# Altium schematic sheet Filter_Circuit.SchDoc
size A4; SheetNumber: 5; SheetTotal: 6
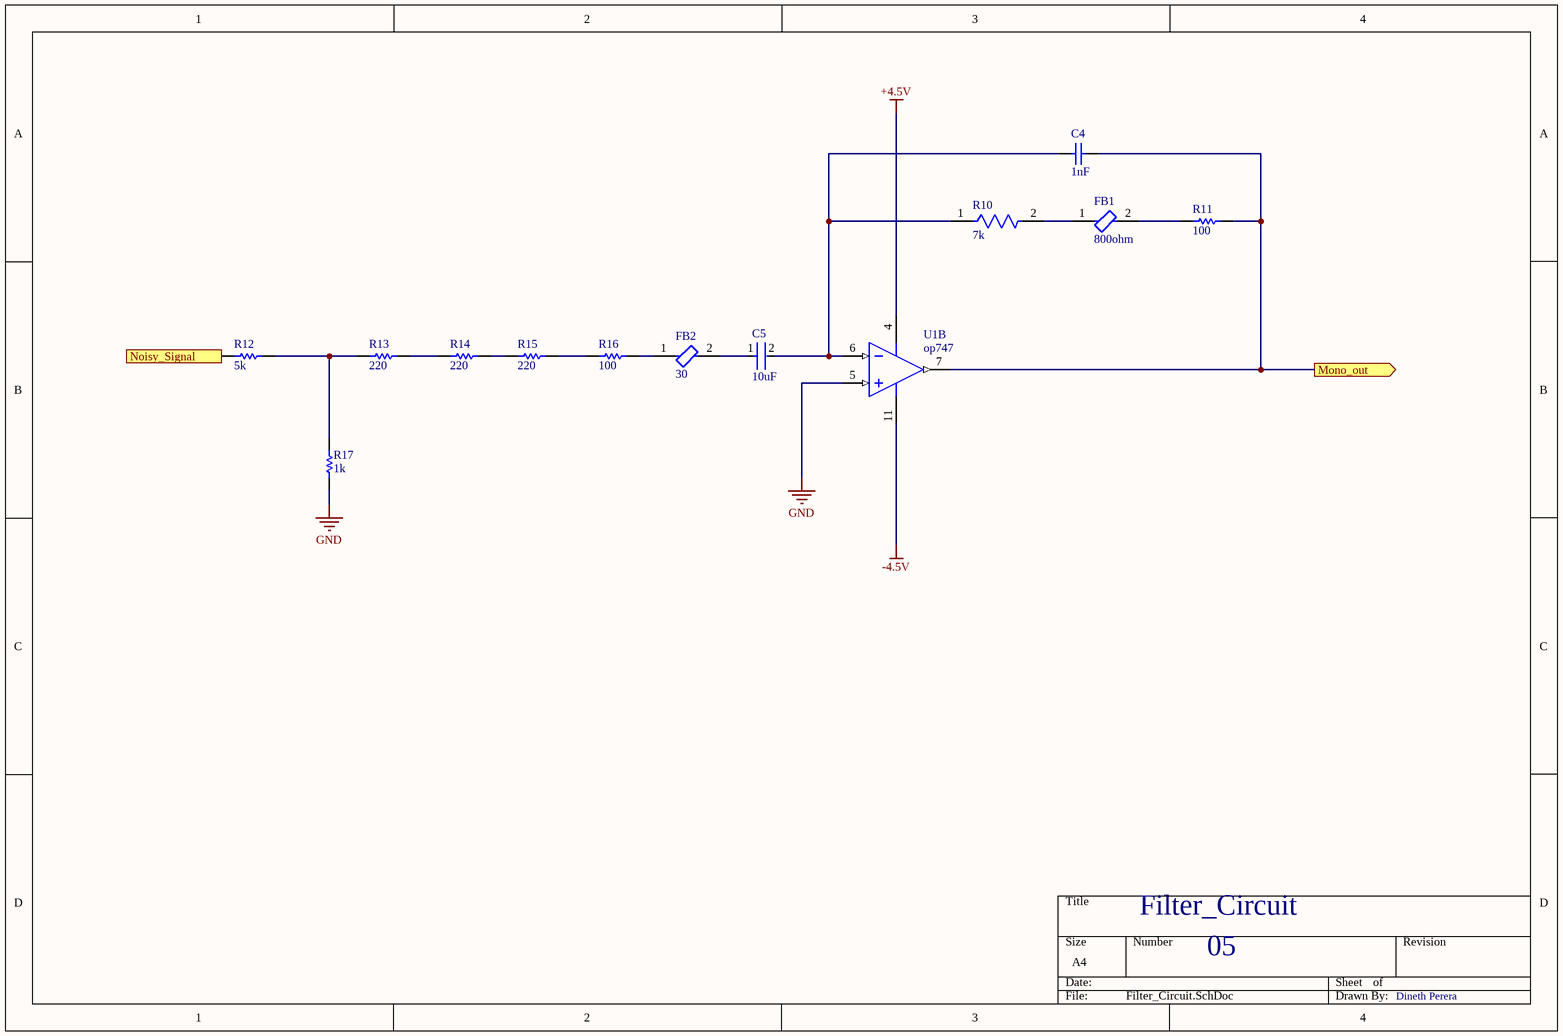
[diagram p0: Filter_Circuit.SchDoc]

## Parts
C4  1nF  [CAPC1608X90X35NL10T15]
C5  10uF  [FP-C0805C-DG-MFG]
FB1  800ohm  [FP-BLM31-0_2-t1_6-IPC_A]
FB2  30  [FP-BLM21-0_2-t0_85-e0_5-d-MFG]
R10  7k  [FP-RMCF0805-MFG]
R11  100  [RESC1005X40X25LL05T05]
R12  5k  [RESC2013X50X30NL20T20]
R13  220  [RESC2013X70X40NL20T20]
R14  220  [RESC2013X70X40NL20T20]
R15  220  [RESC2013X70X40NL20T20]
R16  100  [RESC2013X60X40ML20T25]
R17  1k  [RESC2013X70X40LL20T20]
U1  op747  [ADI-R-14_L]  (part B of 4)

## Ports
Mono_out (out), Noisy_Signal (in)

## Nets
+4.5V: U1.4(+V)
-4.5V: U1.11(-V)
GND: R17.1 U1.5(+IN_B)
Mono_out: C4.2 R11.2 U1.7(OUT_B) ; port Mono_out
Noisy_Signal: R12.1 ; port Noisy_Signal
NetC4_1: C4.1 C5.2 R10.1 U1.6(-IN_B)
NetC5_1: C5.1 FB2.2
NetFB1_1: FB1.1 R10.2
NetFB1_2: FB1.2 R11.1
NetFB2_1: FB2.1 R16.2
NetR12_2: R12.2 R13.1 R17.2
NetR13_2: R13.2 R14.1
NetR14_2: R14.2 R15.1
NetR15_2: R15.2 R16.1

## Notes on the sheet
- Filter_Circuit
- 05
- Dineth Perera

## Library data of the parts
C4 = CMP-2006-02891-1: Part Number: GRM188R71H102KA01D; Manufacturer: Murata
C5 = CMP-2007-03243-2: CAP CER 10UF 10V X5R 0805; Manufacturer Part Number: C0805C106K8PACTU; Manufacturer: Kemet; 3DS Part Number: 220-00001; Tolerance: 10%; Description: SMD Comm X5R, Ceramic, 10 uF, 10%, 10 V, X5R, SMD, MLCC, Temperature Stable, Class II, 0805; Temperature Coefficient: 15%; Material: Ceramic; Device Class L2: Capacitors; Device Class L1: Passive Components; ComponentLink2URL: https://content.kemet.com/datasheets/KEM_C1006_X5R_SMD.pdf; Height: 1.4mm; Lead Free: Yes; Digikey Description: CAP CER 10UF 10V X5R 0805; Octopart: https://octopart.com/c0805c106k8pactu-kemet-98697; Capacitance: 10uF; Value: 10uF; Temperature Range Low: -55°C; Temperature: -55°C to +85°C; Automotive: No; Mouser Description: CAP CER 10UF 10V X5R 0805; Ipc Land Pattern Name: CAPC200125X125; Temperature Range High: +85°C; Voltage: 10V; RoHS: TRUE; Device Class L3: Ceramic Capacitors; ComponentLink2Description: Datasheet; Voltage Rating: 10V; Package: C0805C-DG; Temperature Characteristic: X5R; Category: Cap
FB1 = CMP-06046-002102-1: Chip Ferrite Bead, 1206, 800Ω @ 100MHz, 0.05Ω, 25%, 2.5A; DC Resistance (DCR): 50mR; Number of Lines: 1; Case Code (Metric): 3216; Case/Package: 1206; RoHS Compliant: Yes; Max Operating Temperature: 125°C; Min Operating Temperature: -55°C; Packaging: Tape and Reel; Mount: Surface Mount; Ratings: AEC-Q200; Case Code (Imperial): 1206; Max Current Rating: 2.5A
FB2 = CMP-06046-001820-1: Chip Ferrite Bead, 0805, 30Ω @ 100MHz, 0.014Ω, , 4A; Impedance: 30R; Shielding: Unshielded; Max DC Current: 3A; Tolerance: 25%; DC Resistance (DCR): 14mR; Material: Steel; Number of Lines: 1; DC Resistance-Max: 15MR; Core Material: Ferrite; Mount: Surface Mount; Packaging: Tape and Reel; Depth: 1.45mm; Height: 0.041inch; Weight: 0.000194oz; Case Code (Metric): 2012; Ratings: AEC-Q200; Test Frequency: 100MHz; Series: EMIFIL®, BLM21P; Max Operating Temperature: 125°C; Case/Package: 0805; Lead Free: Lead Free; Length: 2mm; REACH SVHC: No SVHC; Case Code (Imperial): 0805; Width: 1.25mm; Package Quantity: 4000; Termination: SMD/SMT; Max Current Rating: 4A; Min Operating Temperature: -55°C; RoHS Compliant: Yes; Current Rating: 3A; Number of Circuits: 1
R10 = CMP-26527-003538-1: 4.7kΩ ±5% 0.125W 0805 Thick Film Chip Resistor AEC-Q200 compliant; Temperature Coefficient: 100ppm/°C; Resistance: 4.7kR; Max Power Dissipation: 125mW; Size Code: 0805; Case/Package: 0805; Mount: Surface Mount; RoHS Compliant: Yes; Height: 0.026inch; Case Code (Imperial): 0805; Military Standard: Not; Contact Plating: Tin; Length: 2mm; Resistor Type: Thick Film; Tolerance: 5%; Depth: 1.25mm; Radiation Hardening: No; Min Operating Temperature: -55°C; Number of Terminations: 2; Width: 0.049inch; Lead Free: Lead Free; Case Code (Metric): 2012; Construction: Rectangular; Packaging: Tape and Reel; Features: Automotive AEC-Q200; Power Rating: 125mW; Max Operating Temperature: 155°C; Series: RMCF
R11 = CMP-2002-00605-3: Chip Resistor, 100 Ohm, +/- 1%, 100 mW, -55 to 155 degC, 0402 (1005 Metric), RoHS, Tape and Reel; Manufacturer: Basic Passives; PartNumber: ERJ-2RKF1000X; Power Rating: 100 mW; Resistance: 100 Ohm; Voltage Rating: 50 V; Case\/Package: 0402; Width: 0.5 mm; Pins: 2; ComponentLink2Description: Datasheet; PackageReference: 0402; Height: 0.35 mm; Tolerance: 1%; DatasheetVersion: 04/2015; Case Code (Imperial): 0402; Min Operating Temperature: -55 degC; Radiation Hardening: No; Length: 1 mm; Package Quantity: 10000; PackageDescription: 2-Pin Surface Mount Device, Body 1 x 0.5 mm; Mounting Technology: Surface Mount; Case Code (Metric): 1005; Packaging: Tape and Reel; ComponentLink1URL: http://www.panasonic.com/; RoHSCompliant: true; Max Operating Temperature: 155 degC; REACH SVHC: Yes; ComponentLink1Description: Manufacturer URL; ComponentLink2URL: http://industrial.panasonic.com/cdbs/www-data/pdf/RDA0000/AOA0000C86.pdf; Mount: Surface Mount
R12 = CMP-2001-04239-1: Part Number: CRCW08055K00FKTA; Manufacturer: Vishay Dale
R13-R15 = CMP-2001-00044-1: Part Number: ERJ6ENF2200V; Manufacturer: Panasonic
R16 = CMP-2001-00580-1: Manufacturer: Panasonic; Part Number: ERA6AEB101V
R17 = CMP-2001-04375-5: Chip Resistor, 1 KOhm, +/- 1%, 0.125 W, -55 to 155 degC, 0805 (2012 Metric), RoHS, Tape and Reel; Manufacturer: Panasonic; Voltage Rating: 150 V; ComponentLink1URL: http://www.panasonic.com/; ComponentLink2Description: Datasheet; REACH SVHC: Yes; ComponentLink1Description: Manufacturer URL; Length: 2 mm; Height: 0.6 mm; Package Quantity: 1; PackageDescription: 2-Pin Surface Mount Device, Body 2 x 1.25 mm; Packaging: Cut Tape; PackageReference: 0805; Max Operating Temperature: 155 degC; Mounting Technology: Surface Mount; ComponentLink2URL: http://industrial.panasonic.com/cdbs/www-data/pdf/RDA0000/AOA0000C86.pdf; DatasheetVersion: 04/2015; Min Operating Temperature: -55 degC; RoHSCompliant: true; Mount: Surface Mount
U1 = CMP-0384-00387-1: Quad Channel Rail-to-Rail Operational Amplifier, 700 KHz BW, 200 mV/us SR, Industrial, 14-pin SOIC (R-14), Reel; Manufacturer: Analog Devices; PartNumber: OP747ARZ-REEL7; Input Bias Current: 5.5nA; Input Offset Voltage: 30uV; Small Signal Bandwidth: 700KHz; V Span Min: 3V; V Span Max: 36V; Amplifiers Per Package: 4; Iq/Amp: 290uA; DatasheetVersion: Rev. D; Mounting Technology: Surface Mount; ComponentLink1URL: http://www.analog.com/en/index.html; PackageVersion: 060606-A; ComponentLink2Description: Datasheet; ComponentLink2URL: http://www.analog.com/static/imported-files/data_sheets/OP777_727_747.pdf; PackageDescription: 14-Pin Standard Small Outline Package, Body 8.65 x 3.9 mm, Pitch 1.27 mm; PackageReference: R-14; ComponentLink3URL: http://www.analog.com/static/imported-files/packages/PKG_PDF/SOIC_Narrow%20(R)/R_14.pdf; Generic Part Number: OP747; ComponentLink3Description: Package Specification; Slew Rate: 200mV/us; ComponentLink1Description: Manufacturer URL; Code_JEDEC: MS-012-AB